# EAGLE design main (EAGLE 9.5.1)
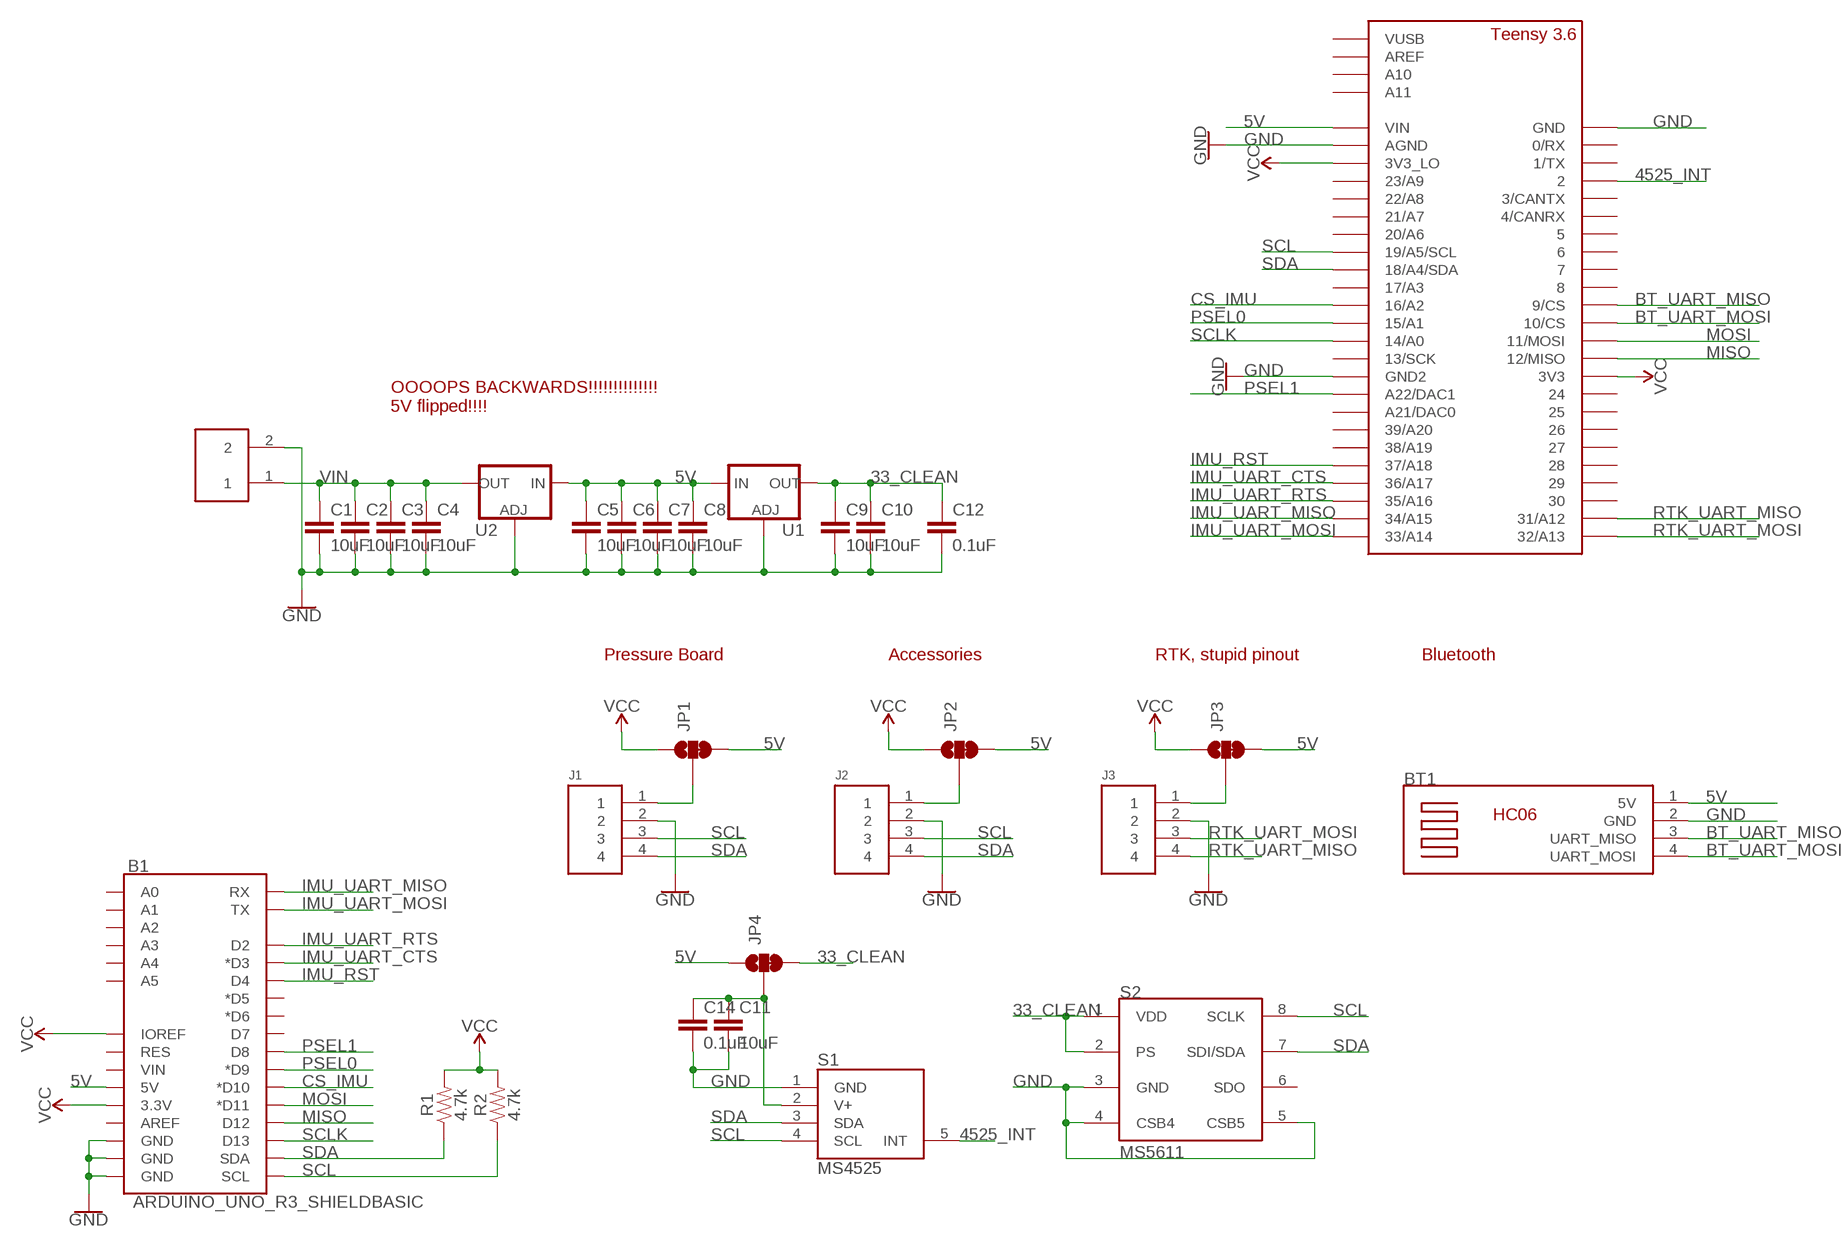
[diagram p0: schematic, sheet 1]

## Parts
B1  ARDUINO_UNO_R3_SHIELDBASIC  [UNO_R3_SHIELD]
BT1  HC06  [HC06]
C1  10uF  10UF-1206-6.3V-20%  [1206]
C2  10uF  10UF-1206-6.3V-20%  [1206]
C3  10uF  10UF-1206-6.3V-20%  [1206]
C4  10uF  10UF-1206-6.3V-20%  [1206]
C5  10uF  10UF-1206-6.3V-20%  [1206]
C6  10uF  10UF-1206-6.3V-20%  [1206]
C7  10uF  10UF-1206-6.3V-20%  [1206]
C8  10uF  10UF-1206-6.3V-20%  [1206]
C9  10uF  10UF-1206-6.3V-20%  [1206]
C10  10uF  10UF-1206-6.3V-20%  [1206]
C11  10uF  10UF-1206-6.3V-20%  [1206]
C12  0.1uF  0.1UF-0603-25V-5%  [0603]
C14  0.1uF  0.1UF-0603-25V-5%  [0603]
J1  HEADER4VALULOK  [4PINVALULOK]
J2  HEADER4VALULOK  [4PINVALULOK]
J3  HEADER4VALULOK  [4PINVALULOK]
JP1  JUMPER-SMT_3_1-NC_TRACE_SILK  [SMT-JUMPER_3_1-NC_TRACE_SILK]
JP2  JUMPER-SMT_3_1-NC_TRACE_SILK  [SMT-JUMPER_3_1-NC_TRACE_SILK]
JP3  JUMPER-SMT_3_1-NC_TRACE_SILK  [SMT-JUMPER_3_1-NC_TRACE_SILK]
JP4  JUMPER-SMT_3_1-NC_TRACE_SILK  [SMT-JUMPER_3_1-NC_TRACE_SILK]
R1  4.7k  4.7KOHM-0603-1/10W-1%  [0603]
R2  4.7k  4.7KOHM-0603-1/10W-1%  [0603]
S1  MS4525  MS4525MS4525DO  [DIP1270W53P254L990H762Q8B]
S2  MS5611  [MS5611]
U1  V_REG_317SMD  [SOT223]
U2  V_REG_317DPACK  [V-REG_DPACK]
U$1  TEENSY_3.5/3.6_BASIC  [TEENSY_3.5/3.6_BASIC]
U$3  HEADER2  [2PINVALULOK]

## Nets
5V: B1.5V BT1.1(5V) C5.1 C6.1 C7.1 C8.1 JP1.3 JP2.3 JP3.3 JP4.1 U1.3(IN) U2.3(IN) U$1.VIN
33_CLEAN: C9.1 C10.1 C12.1 JP4.3 S2.1(VDD) S2.2(PS) U1.2(OUT)
4525_INT: S1.5(INT) U$1.2
BT_UART_MISO: BT1.3(UART_MISO) U$1.9/CS
BT_UART_MOSI: BT1.4(UART_MOSI) U$1.10/CS
CS_IMU: B1.D10(*D10) U$1.16/A2
GND: B1.GND@0(GND) B1.GND@1(GND) B1.GND@2(GND) BT1.2(GND) C1.2 C2.2 C3.2 C4.2 C5.2 C6.2 C7.2 C8.2 C9.2 C10.2 C11.2 C12.2 C14.2 J1.2 J2.2 J3.2 S1.1(GND) S2.3(GND) S2.4(CSB4) S2.5(CSB5) U1.1(ADJ) U2.1(ADJ) U$1.AGND U$1.GND U$1.GND2 U$3.2
IMU_RST: B1.D4 U$1.37/A18
IMU_UART_CTS: B1.D3(*D3) U$1.36/A17
IMU_UART_MISO: B1.RX U$1.34/A15
IMU_UART_MOSI: B1.TX U$1.33/A14
IMU_UART_RTS: B1.D2 U$1.35/A16
MISO: B1.D12 U$1.12/MISO
MOSI: B1.D11(*D11) U$1.11/MOSI
N$1: J2.1 JP2.2
N$2: J1.1 JP1.2
N$3: J3.1 JP3.2
N$4: C11.1 C14.1 JP4.2 S1.2(V+)
PSEL0: B1.D9(*D9) U$1.15/A1
PSEL1: B1.D8 U$1.A22/DAC1
RTK_UART_MISO: J3.4 U$1.31/A12
RTK_UART_MOSI: J3.3 U$1.32/A13
SCL: B1.SCL J1.3 J2.3 R2.1 S1.4(SCL) S2.8(SCLK) U$1.19/A5/SCL
SCLK: B1.D13 U$1.14/A0
SDA: B1.SDA J1.4 J2.4 R1.1 S1.3(SDA) S2.7(SDI/SDA) U$1.18/A4/SDA
VCC: B1.3.3V B1.IOREF JP1.1 JP2.1 JP3.1 R1.2 R2.2 U$1.3V3 U$1.3V3_LO
VIN: C1.1 C2.1 C3.1 C4.1 U2.4(OUT) U$3.1
Unconnected: B1.A0 B1.A1 B1.A2 B1.A3 B1.A4 B1.A5 B1.AREF B1.D5(*D5) B1.D6(*D6) B1.D7 B1.RES B1.VIN S2.6(SDO) U$1.0/RX U$1.1/TX U$1.3/CANTX U$1.4/CANRX U$1.5 U$1.6 U$1.7 U$1.8 U$1.13/SCK U$1.17/A3 U$1.20/A6 U$1.21/A7 U$1.21/DAC0(A21/DAC0) U$1.22/A8 U$1.23/A9 U$1.24 U$1.25 U$1.26 U$1.27 U$1.28 U$1.29 U$1.30 U$1.38/A19 U$1.39/A20 U$1.A10 U$1.A11 U$1.AREF U$1.VUSB

## Notes on the sheet
- OOOOPS BACKWARDS!!!!!!!!!!!!!!
  5V flipped!!!!
- Pressure Board | Accessories | RTK, stupid pinout | Bluetooth

## Library data of the parts
B1 = SparkFun-Boards:ARDUINO_UNO_R3_SHIELD: Arduino R3 Shield Footprint Shield form compatible with the Arduino Uno R3. SparkFun Products: MG2639 Cellular Shield <https://www.sparkfun.com/products/13120> MIDI Shield <https://www.sparkfun.com/products/12898> R3 Stackable Headers Kit <https://www.sparkfun.com/products/11417>
BT1 = 2020:HC06
C1-C11 = SparkFun-Capacitors:10UF: 10.0µF ceramic capacitors A capacitor is a passive two-terminal electrical component used to store electrical energy temporarily in an electric field.; PROD_ID: CAP-10057
C12 C14 = SparkFun-Capacitors:0.1UF: 0.1µF ceramic capacitors A capacitor is a passive two-terminal electrical component used to store electrical energy temporarily in an electric field.; PROD_ID: CAP-08604
J1-J3 = Custom_old:HEADER4
JP1-JP4 = SparkFun-Jumpers:JUMPER-SMT_3_1-NC_TRACE: Normally closed trace jumper (1 of 2 connections) This jumper has a trace between two pads so it's normally closed (NC). The other connection is normally open (NO). Use a razor knife to open the connection. For best results follow the IPC guidelines for cutting traces: Cutout at least 0.063 mm (0.005 in). Remove all loose material to clean up the cut area. Seal the cut with an approved epoxy. Reapply solder to reclose the connection, or to close the NO connection.
R1 R2 = SparkFun-Resistors:4.7KOHM: 4.7kΩ resistor A resistor is a passive two-terminal electrical component that implements electrical resistance as a circuit element. Resistors act to reduce current flow, and, at the same time, act to lower voltage levels within circuits. - Wikipedia; PROD_ID: RES-07857
S1 = 2020:MS4525
S2 = Custom_old:MS5611
U1 = SparkFun-IC-Power:V_REG_317: Voltage Regulator Standard LM317 adjustable voltage regulator. AOI (Adjust Output Input). Google 'LM317 Calculator' for easy to use app to get the two resistor values needed. 240/720 for 5V output. 240/390 for 3.3V output. Spark Fun Electronics SKU : COM-00527
U2 = SparkFun-IC-Power:V_REG_317: Voltage Regulator Standard LM317 adjustable voltage regulator. AOI (Adjust Output Input). Google 'LM317 Calculator' for easy to use app to get the two resistor values needed. 240/720 for 5V output. 240/390 for 3.3V output. Spark Fun Electronics SKU : COM-00527; PROD_ID: IC-09888
U$1 = Teensy356:TEENSY_3.5/3.6_BASIC
U$3 = Custom_old:HEADER2

## Board
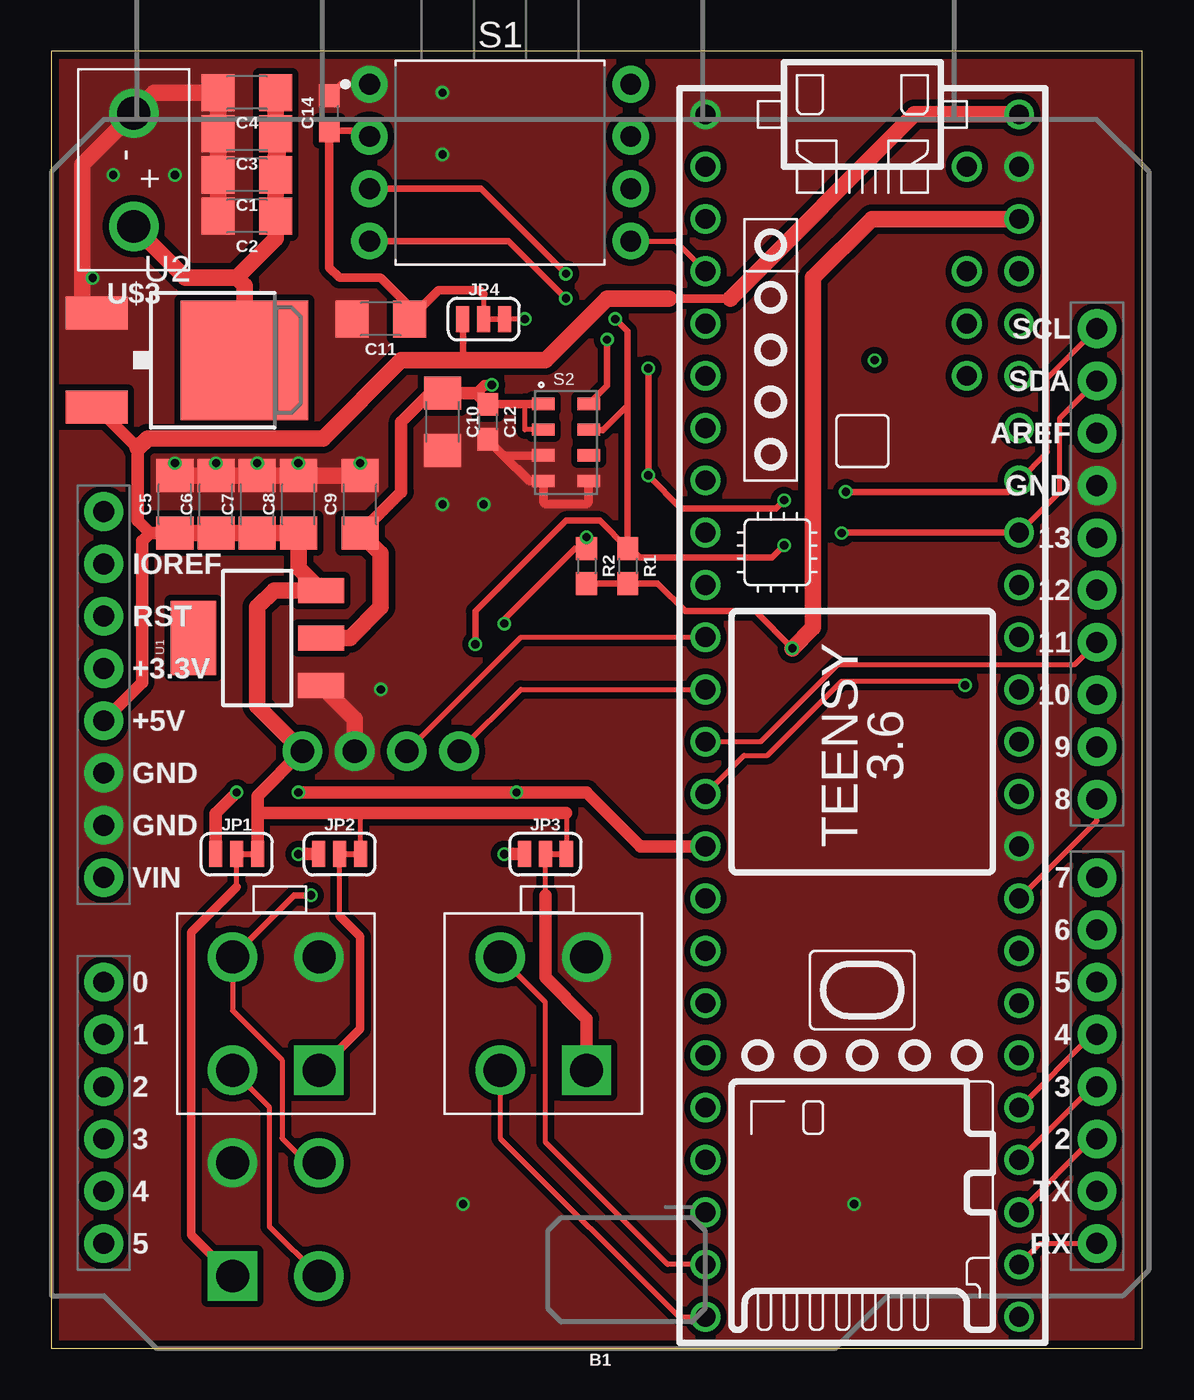
[diagram p1: board, top side]
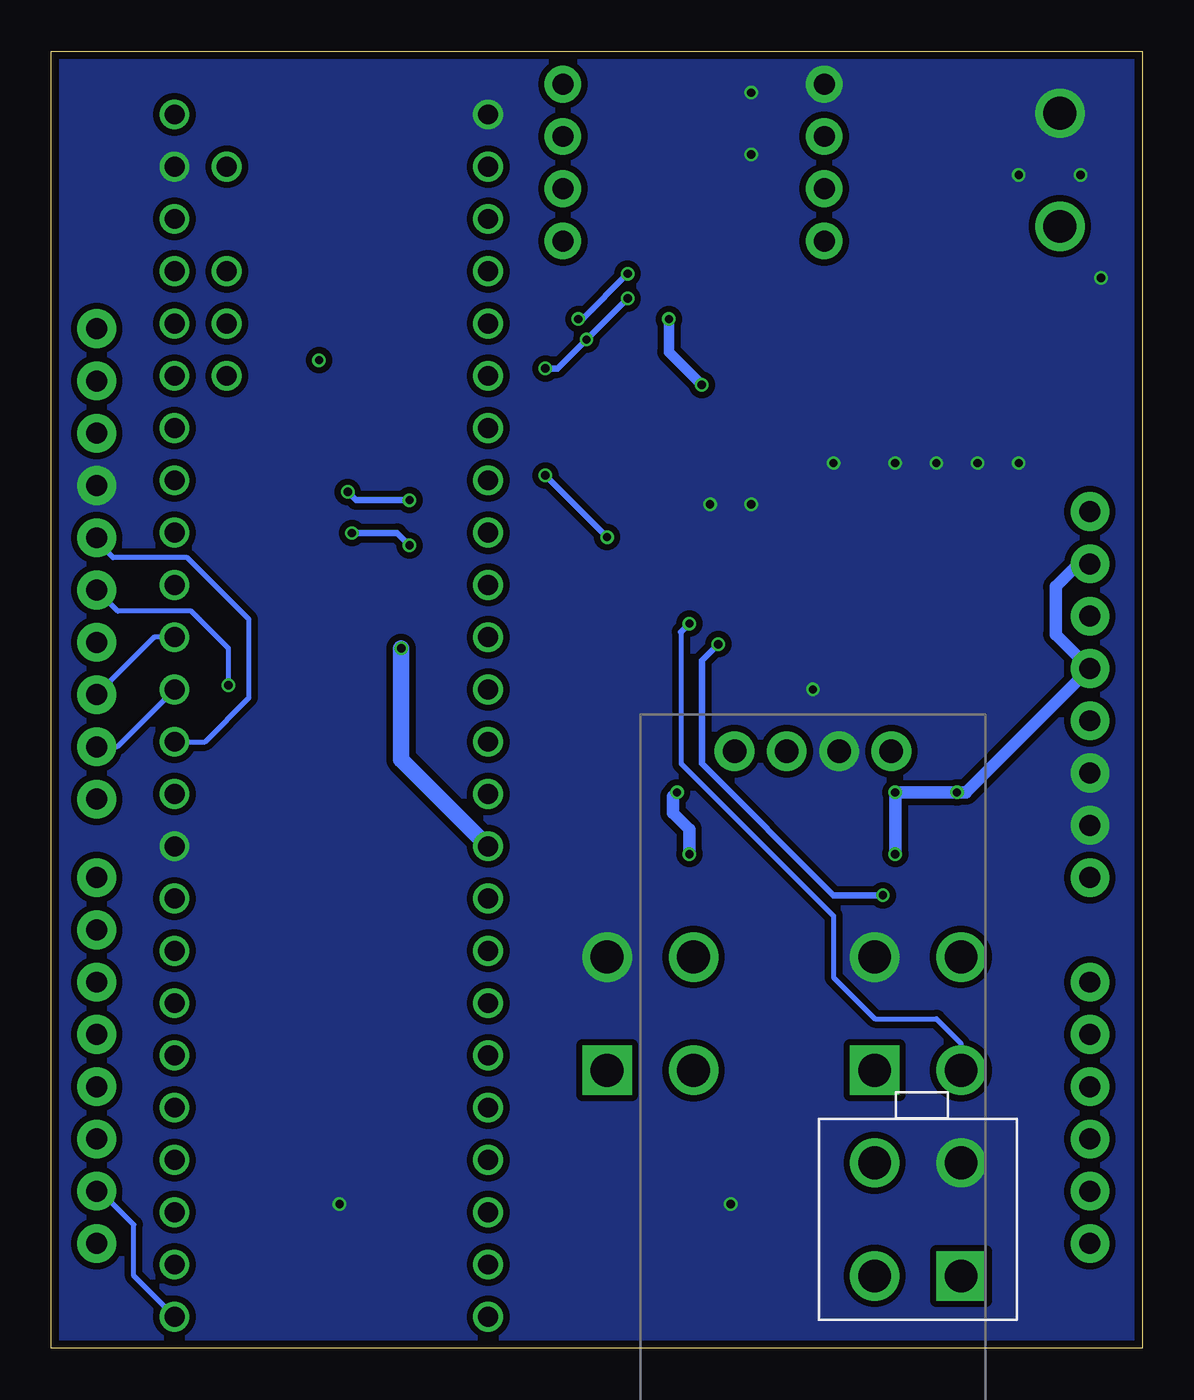
[diagram p2: board, bottom side, seen from below]

Size 53 x 63 mm. Coordinates in mm from the lower left corner, seen from the top.
Outline: 0,0 53,0 53,63 0,63 0,0
Copper layers (1*16): Top 0.035559375mm / dielectric 1.6mm / Bottom 0.035559375mm
Design rules "PATRICK-2lyr": minimum track width 6mil, minimum drill 10mil, track to track 6mil, track to pad 6mil, pad to pad 6mil, via to via 6mil, smd to smd 6mil, copper to edge 15mil, drill to drill 6mil, minimum pad ring 5mil, minimum via ring 5mil, stop-mask expansion 2.5mil, vias tented up to drill 25mil, thermal gap 10mil

### Footprints (pad centres in the part's own frame; a part is rotated, then mirrored left to right if it is on the bottom)
UNO_R3_SHIELD = drill 1.016 pad 1.88: 3.3V 24.13,-2.54; 5V 24.13,0; A0 24.13,12.7; A1 24.13,15.24; A2 24.13,17.78; A3 24.13,20.32; A4 24.13,22.86; A5 24.13,25.4; AREF -24.13,-13.97; D2 -24.13,20.32; D3 -24.13,17.78; D4 -24.13,15.24; D5 -24.13,12.7; D6 -24.13,10.16; D7 -24.13,7.62; D8 -24.13,3.81; D9 -24.13,1.27; D10 -24.13,-1.27; D11 -24.13,-3.81; D12 -24.13,-6.35; D13 -24.13,-8.89; GND@0 24.13,2.54; GND@1 24.13,5.08; GND@2 -24.13,-11.43; IOREF 24.13,-7.62; NC 24.13,-10.16; RES 24.13,-5.08; RX -24.13,25.4; SCL -24.13,-19.05; SDA -24.13,-16.51; TX -24.13,22.86; VIN 24.13,7.62
HC06 = drill 1.143 pad 1.93: 1 -3.81,0; 2 -1.27,0; 3 1.27,0; 4 3.81,0
1206 = smd 1.6 x 1.8: 1 -1.4,0; 2 1.4,0
0603 = smd 1.1 x 1: 1 -0.85,0; 2 0.85,0
4PINVALULOK = drill 1.6 square: 1 0,5.5 | drill 1.6: 2 0,0; 3 4.2,5.5; 4 4.2,0
SMT-JUMPER_3_1-NC_TRACE_SILK = smd 0.635 x 1.27: 1 -1.016,0; 2 0,0; 3 1.016,0
DIP1270W53P254L990H762Q8B = drill 1.016 pad 1.778: 1 -6.35,3.81; 2 -6.35,1.27; 3 -6.35,-1.27; 4 -6.35,-3.81; 5 6.35,-3.81; 6 6.35,-1.27; 7 6.35,1.27; 8 6.35,3.81
MS5611 = smd 1.1 x 0.6: 1 -1.1,1.875; 2 -1.1,0.625; 3 -1.1,-0.625; 4 -1.1,-1.875; 5 1.1,-1.875; 6 1.1,-0.625; 7 1.1,0.625; 8 1.1,1.875
SOT223 = smd 1.219 x 2.235: 1 -2.311,-3.099; 2 0,-3.099; 3 2.311,-3.099 | smd 3.6 x 2.2: 4 0,3.099
V-REG_DPACK = smd 1.6 x 3: 1 -2.28,-4.8; 3 2.28,-4.8 | smd 5.8 x 6.2: 4 0,2.38
TEENSY_3.5/3.6_BASIC = drill 0.965: 0/RX -25.4,-7.62; 1/TX -22.86,-7.62; 2 -20.32,-7.62; 3/CANTX -17.78,-7.62; 3V3 7.62,-7.62; 3V3_LO -22.86,7.62; 4/CANRX -15.24,-7.62; 5 -12.7,-7.62; 6 -10.16,-7.62; 7 -7.62,-7.62; 8 -5.08,-7.62; 9/CS -2.54,-7.62; 10/CS 0,-7.62; 11/MOSI 2.54,-7.62; 12/MISO 5.08,-7.62; 13/SCK 5.08,7.62; 14/A0 2.54,7.62; 15/A1 0,7.62; 16/A2 -2.54,7.62; 17/A3 -5.08,7.62; 18/A4/SDA -7.62,7.62; 19/A5/SCL -10.16,7.62; 20/A6 -12.7,7.62; 21/A7 -15.24,7.62; 21/DAC0 12.7,7.62; 22/A8 -17.78,7.62; 23/A9 -20.32,7.62; 24 10.16,-7.62; 25 12.7,-7.62; 26 15.24,-7.62; 27 17.78,-7.62; 28 20.32,-7.62; 29 22.86,-7.62; 30 25.4,-7.62; 31/A12 27.94,-7.62; 32/A13 30.48,-7.62; 33/A14 30.48,7.62; 34/A15 27.94,7.62; 35/A16 25.4,7.62; 36/A17 22.86,7.62; 37/A18 20.32,7.62; 38/A19 17.78,7.62; 39/A20 15.24,7.62; A10 -17.78,5.08; A11 -15.24,5.08; A22/DAC1 10.16,7.62; AGND -25.4,7.62; AREF -20.32,5.08; GND -27.94,-7.62; GND2 7.62,7.62; VIN -27.94,7.62; VUSB -25.4,5.08
2PINVALULOK = drill 1.6: 1 0,5.5; 2 0,0

### Placement (x,y rotation side)
B1  26.67,30.48 180 top
BT1  16,29 180 bottom
C1  9.5,57 180 top
C2  9.5,55 180 top
C3  9.5,59 180 top
C4  9.5,61 180 top
C5  6,41 90 top
C6  8,41 90 top
C7  10,41 90 top
C8  12,41 90 top
C9  15,41 90 top
C10  19,45 270 top
C11  16,50 180 top
C12  21.2,45 270 top
C14  13.5,60 90 top
J1  8.8,9 180 bottom
J2  13,19 180 top
J3  26,19 180 top
JP1  9,24 0 top
JP2  14,24 0 top
JP3  24,24 0 top
JP4  21,50 0 top
R1  28,38 270 top
R2  26,38 270 top
S1  21.8,57.6 0 top
S2  25,44 0 top
U1  10,34.5 90 top
U2  7,48 270 top
U$1  39.4,32 270 top
U$3  4,60 180 top

### Tracks (layer width: path | path; a pad name or v marks a point on that pad's centre or on a via)
5V
  Top 0.254: 25,26 25.02,25.98 JP3.3 | 15,26 15,24.02 JP2.3
  Top 0.305: JP4.1 20,49.98 20,48
  Top 0.406: 33,51 30,51
  Top 0.61: U2.3 4.2,43.72 4.2,40.2 4.8,39.6 | 4.8,39.6 C5.1 | B1.5V 4.4,32.34 4.4,39.2 4.8,39.6 | JP1.3 10.02,26 | 10.02,26 10.02,26.83 BT1.1 | 10.02,26 15,26 25,26
  Top 0.813: C5.1 C6.1 C7.1 C8.1 12,37.91 U1.3 10.81,36.81 10,36 10,31.19 BT1.1 | U$1.VIN 41.94,59.94 33,51 | 30,51 27,51 24,48 20,48 17,48 13.2,44.2 4.68,44.2 4.2,43.72
33_CLEAN  (via drill 0.4)
  Top 0.254: S2.2 23,44.62 23,45.88 | v23,50 JP4.3
  Top 0.406: C12.1 21.23,45.88 23,45.88 S2.1
  Top 0.508: v21.4,46.8 21.05,46.8 20.65,46.4
  Top 0.61: C9.1 17,41.6 17,45 18.4,46.4 C10.1 20.65,46.4 C12.1
  Top 0.813: U1.2 14.5,34.5 16,36 16,38.6 C9.1
  Bottom 0.508: v23,50 23,48.4 v21.4,46.8
4525_INT
  Top 0.254: S1.5 30.31,53.79 U$1.2
BT_UART_MISO
  Top 0.254: BT1.3 22.81,34.54 U$1.9/CS
BT_UART_MOSI
  Top 0.254: BT1.4 22.81,32 U$1.10/CS
CS_IMU
  Bottom 0.254: U$1.16/A2 48.01,34.54 B1.D10
GND  (via drill 0.4)
  Top 0.305: C14.2 14.06,61.41 S1.1
  Top 0.406: C12.2 21.98,43.38 | 21.98,43.38 S2.3 | 21.98,43.38 23.23,42.12 S2.4 23.9,41.1 24,41 26,41 26.1,41.1 S2.5
  Top 0.813: U2.1 1.5,50.98 1.5,57.5 U$3.2 5,61 C4.2 C3.2 C1.2 C2.2 | C5.2 C6.2 C7.2 C8.2 C9.2 | BT1.2 14.73,30.56 U1.1
  other vias: 6,43 8,43 10,43 12,43 15,43 19,41 21,41 39,7 20,7 2,52 3,57 6,57 16,32 19,61 19,58
  pour Bottom (isolate 0.305, no thermals): -1,64 54,64 54,-1 -1,-1
  pour Top (isolate 0.305, no thermals): -2,65 55,65 55,-2 -2,-2
IMU_RST
  Top 0.254: U$1.37/A18 50.58,15.24 B1.D4
IMU_UART_CTS
  Top 0.254: U$1.36/A17 50.58,12.7 B1.D3
IMU_UART_MISO
  Top 0.254: U$1.34/A15 48.04,5.08 B1.RX
IMU_UART_MOSI
  Bottom 0.254: U$1.33/A14 49,3.5 49,6 50.62,7.62 B1.TX
IMU_UART_RTS
  Top 0.254: U$1.35/A16 50.58,10.16 B1.D2
MISO  (via drill 0.4)
  Top 0.254: U$1.12/MISO 33.66,28.8 34.8,28.8 38.4,32.4 44.4,32.4 v44.4,32.2
  Bottom 0.254: v44.4,32.2 44.4,34 46.2,35.8 49.77,35.8 B1.D12
MOSI
  Top 0.254: B1.D11 49.71,33.2 38.2,33.2 34.46,29.46 U$1.11/MOSI
N$1
  Top 0.254: 14,21 JP2.2
  Top 0.406: 14,21 15,20 15,15.5 J2.1
N$2
  Top 0.254: 9,22.4 JP1.2
  Top 0.406: 9,22.4 6.8,20.2 6.8,5.5 J1.1
N$3
  Top 0.254: 24,22 JP3.2
  Top 0.61: J3.1 26,16 24,18 24,22
N$4
  Top 0.254: 21,51.2 JP4.2
  Top 0.305: C14.1 15.17,59.15 S1.2
  Top 0.406: C14.1 13.5,52.5 14,52 16,52 17.4,50.6 C11.1 18.8,51.4 20.8,51.4 21,51.2
N$7  (via drill 0.4)
  other vias: 40,48
PSEL0
  Bottom 0.254: U$1.15/A1 49.81,29.21 B1.D9
PSEL1
  Top 0.254: U$1.A22/DAC1 50.8,25.62 B1.D8
RTK_UART_MISO
  Top 0.254: U$1.31/A12 29.94,4.06 24,10 24,16.8 J3.4
RTK_UART_MOSI
  Top 0.254: J3.3 21.8,10.2 30.48,1.52 U$1.32/A13
SCL  (via drill 0.4)
  Top 0.254: U$1.19/A5/SCL 48.4,43.54 48.4,47.13 B1.SCL | J1.3 10.6,5.9 10.6,11.7 J2.3
  Top 0.305: S1.4 22.21,53.79 v25,51 | v27,49 27,46.77 S2.8 | v26,39.4 R2.1 25.45,38.85 22,35.4 v22,35.2 | v29,47.6 v29,42.4 30.6,40.8 35.2,40.8 v35.6,41.2 | U$1.19/A5/SCL 46.46,41.6 v38.6,41.6
  Bottom 0.254: J2.3 8.8,14.8 10,16 13,16 15,18 15,21 22.4,28.4 22.4,34.8
  Bottom 0.305: v25,51 v27,49 28.4,47.6 v29,47.6 | v26,39.4 v29,42.4 | v38.6,41.6 38.2,41.2 v35.6,41.2 | v22,35.2 22.4,34.8
SCLK
  Bottom 0.254: U$1.14/A0 45.54,29.46 43.4,31.6 43.4,35.4 46.4,38.4 50,38.4 50.8,39.2 B1.D13
SDA  (via drill 0.4)
  Top 0.254: U$1.18/A4/SDA 49,41.6 49,45.19 B1.SDA | J2.4 8.8,16.4 11.2,14 11.2,10.2 12.4,9 J1.4
  Top 0.305: S1.3 20.87,56.33 v25,52.2 | v27.4,50 28,49.4 28,45.8 | 28,45.8 26.8,44.6 26.12,44.6 S2.7 | 28,45.8 28,39 | 28,39 R1.1 26.65,40.2 25,40.2 20.6,35.8 v20.6,34.2 | U$1.18/A4/SDA 38.42,39.62 v38.4,39.6 | v35.6,39 35,38.4 28.6,38.4 28,39 | v12.6,22 11.8,22 J2.4
  Bottom 0.305: v25,52.2 27.2,50 v27.4,50 | v38.4,39.6 36.2,39.6 v35.6,39 | v20.6,34.2 21.4,33.4 21.4,28.4 15,22 v12.6,22
VCC  (via drill 0.4)
  Top 0.305: R2.2 R1.2 29.45,37.15 30.8,35.8 34.2,35.8 v36,34
  Top 0.61: U$1.3V3 28.62,24.38 26,27 v22.6,27 v12,27 | v9,27 7.98,25.98 JP1.1 | v12,24 JP2.1 | JP3.1 v22,24
  Top 0.813: U$1.3V3_LO 39.86,54.86 37,52 37,35 v36,34
  Bottom 0.61: B1.IOREF 3.1,38.1 4.2,37 4.2,34.68 B1.3.3V 8.56,27 v9,27 v12,27 v12,24 | v22,24 22,25.2 22.8,26 22.8,26.8 v22.6,27
  Bottom 0.813: v36,34 36,28.6 U$1.3V3
VIN
  Top 0.813: U$3.1 6.5,52 9,52 | 9,52 9.38,51.62 U2.4 | C4.1 C3.1 11,58.9 11,58 10.9,57.9 C1.1 C2.1 10.9,53.9 9,52